# Altium schematic sheet 1_Main.SchDoc: Power, MCU, Control
size 292 x 206 mm; DrawnBy: Martin Cejp; SheetNumber: 1; SheetTotal: 2; TemplateRevision: v2.0
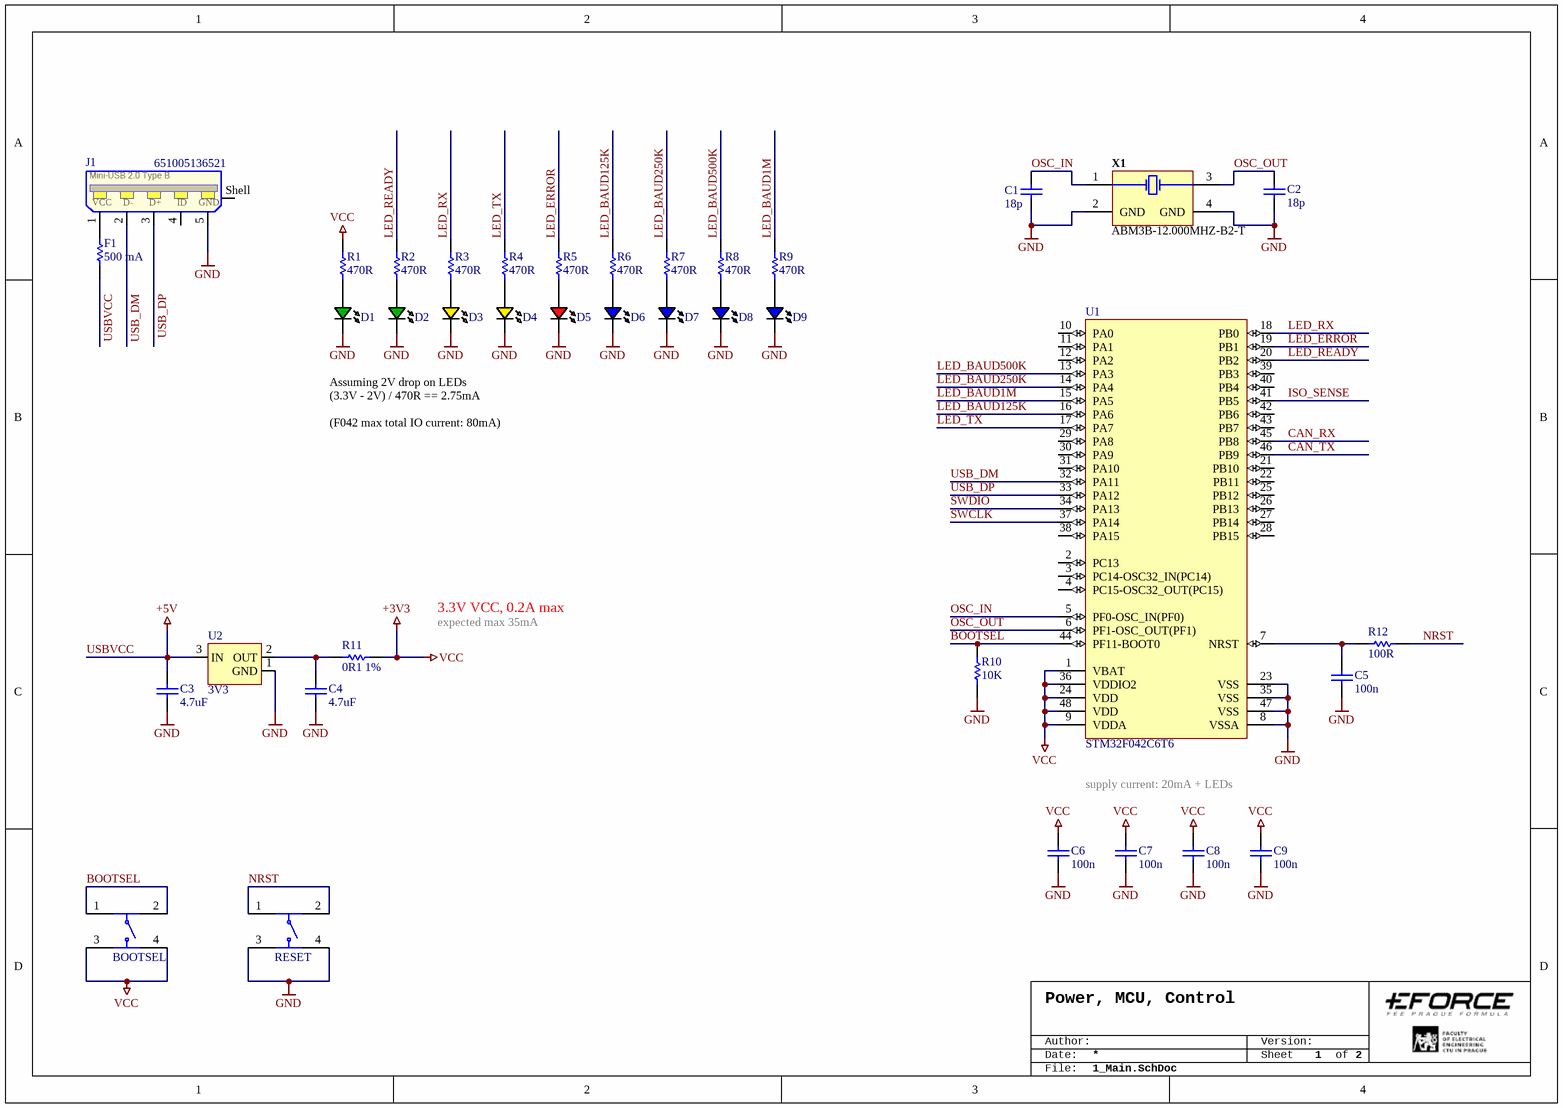
[diagram p0: 1_Main.SchDoc]

## Parts
BOOTSEL  430181038816  [BUTTON_4x3x2]  (value not drawn)
C1  18p  [CAPC0603(1608)100_M]
C2  18p  [CAPC0603(1608)100_M]
C3  4.7uF  [CAPC0805(2012)155_M]
C4  4.7uF  [CAPC0805(2012)155_M]
C5  100n  [CAPC0603(1608)100_M]
C6  100n  [CAPC0603(1608)100_M]
C7  100n  [CAPC0603(1608)100_M]
C8  100n  [CAPC0603(1608)100_M]
C9  100n  [CAPC0603(1608)100_M]
D1  green  [0805LEDG]  (value not drawn)
D2  green  [0805LEDG]  (value not drawn)
D3  yellow  [0805LEDYell]  (value not drawn)
D4  yellow  [0805LEDYell]  (value not drawn)
D5  red  [0805LEDR]  (value not drawn)
D6  blue  [0805LEDB]  (value not drawn)
D7  blue  [0805LEDB]  (value not drawn)
D8  blue  [0805LEDB]  (value not drawn)
D9  blue  [0805LEDB]  (value not drawn)
F1  500 mA  [RESC1812(4532)_L]
J1  651005136521  [MOLEX_548190519]
R1  470R  [RESC0603(1608)_N]
R2  470R  [RESC0603(1608)_N]
R3  470R  [RESC0603(1608)_N]
R4  470R  [RESC0603(1608)_N]
R5  470R  [RESC0603(1608)_N]
R6  470R  [RESC0603(1608)_N]
R7  470R  [RESC0603(1608)_N]
R8  470R  [RESC0603(1608)_N]
R9  470R  [RESC0603(1608)_N]
R10  10K  [RESC0603(1608)_N]
R11  0R1 1%  [RESC1206(3216)_L]
R12  100R  [RESC0603(1608)_L]
RESET  430181038816  [BUTTON_4x3x2]  (value not drawn)
U1  STM32F042C6T6  [STM-LQFP48_M]
U2  3V3  [SOT23m]
X1  ABM3B-12.000MHZ-B2-T  [ABRA-ABM3B-4_V]

## Nets
+3V3: BOOTSEL.3 BOOTSEL.4 C6.1 C7.1 C8.1 C9.1 R1.2 R11.2 U1.1(VBAT) U1.9(VDDA) U1.24(VDD) U1.36(VDDIO2) U1.48(VDD)  [also labelled VCC]
GND: C1.1 C2.1 C3.1 C4.1 C5.1 C6.2 C7.2 C8.2 C9.2 D1.K D2.K D3.K D4.K D5.K D6.K D7.K D8.K D9.K J1.5(GND) R10.1 RESET.3 RESET.4 U1.8(VSSA) U1.23(VSS) U1.35(VSS) U1.47(VSS) U2.1(GND) X1.2(GND) X1.4(GND)
USBVCC: C3.2 F1.2 U2.3(IN)  [also labelled +5V]
BOOTSEL: BOOTSEL.1 BOOTSEL.2 R10.2 U1.44(PF11-BOOT0)
CAN_RX: U1.45(PB8)
CAN_TX: U1.46(PB9)
ISO_SENSE: U1.41(PB5)
LED_BAUD1M: R9.1 U1.15(PA5)
LED_BAUD125K: R6.1 U1.16(PA6)
LED_BAUD250K: R7.1 U1.14(PA4)
LED_BAUD500K: R8.1 U1.13(PA3)
LED_ERROR: R5.1 U1.19(PB1)
LED_READY: R2.2 U1.20(PB2)
LED_RX: R3.1 U1.18(PB0)
LED_TX: R4.1 U1.17(PA7)
NRST: R12.2 RESET.1 RESET.2
OSC_IN: C1.2 U1.5(PF0-OSC_IN(PF0)) X1.1(X1)
OSC_OUT: C2.2 U1.6(PF1-OSC_OUT(PF1)) X1.3(X2)
SWCLK: U1.37(PA14)
SWDIO: U1.34(PA13)
USB_DM: J1.2(D-) U1.32(PA11)
USB_DP: J1.3(D+) U1.33(PA12)
NetC4_2: C4.2 R11.1 U2.2(OUT)
NetC5_2: C5.2 R12.1 U1.7(NRST)
NetD1_A: D1.A R1.1
NetD2_A: D2.A R2.1
NetD3_A: D3.A R3.2
NetD4_A: D4.A R4.2
NetD5_A: D5.A R5.2
NetD6_A: D6.A R6.2
NetD7_A: D7.A R7.2
NetD8_A: D8.A R8.2
NetD9_A: D9.A R9.2
NetF1_1: F1.1 J1.1(VCC)

Not connected (* = marked no-connect by the designer): J1 4(ID) Shell; U1 2(PC13) 3(PC14-OSC32_IN(PC14)) 4(PC15-OSC32_OUT(PC15)) 10(PA0) 11(PA1) 12(PA2) 21(PB10) 22(PB11) 25(PB12) 26(PB13) 27(PB14) 28(PB15) 29(PA8) 30(PA9) 31(PA10) 38(PA15) 39(PB3) 40(PB4) 42(PB6) 43(PB7)

## Notes on the sheet
- Assuming 2V drop on LEDs
  (3.3V - 2V) / 470R == 2.75mA
  (F042 max total IO current: 80mA)
- 3.3V VCC, 0.2A max
- expected max 35mA
- supply current: 20mA + LEDs
- Date:
- Author:
- Sheet
- Version:
- of
- File:
- (in symbol 651005136521) Mini-USB 2.0 Type B

## Library data of the parts
BOOTSEL RESET = WS-TASV, 430181038816: WS-TASV 4.5x4.5 mm SMD; Manufacturer: Wurth Elektronik; partNo: 430181038816; ComponentLink1Description: Manufacturer; ComponentLink1URL: http://www.we-online.de; Created by: Baojun Chen; Created Date: Dec.2015; ComponentLink2Description: Datasheet; ComponentLink2URL: http://katalog.we-online.de/em/datasheet/430181038816.pdf
C1 C2 = CMP-1035-00733-1: CAP 18pF 10V ±10% 0603 (1608 Metric) Thickness 1mm SMD; Case-Metric: 1608; Tolerance: Â±10%; Case-EIA: 0603; Technology: SMT; Value: 18pF; Max Thickness: 1 mm; Rated Voltage: 10 V
C3 C4 = CMP-1036-04892-1: CAP 4.7uF 16V ±20% 0805 (2012 Metric) Thickness 1.55mm SMD; Case-EIA: 0805; Tolerance: Â±20%; Case-Metric: 2012; Rated Voltage: 16 V; Value: 4.7uF; Max Thickness: 1.55 mm; Technology: SMT
C5-C9 = CMP-1035-02576-1: CAP 100nF 6.3V ±10% 0603 (1608 Metric) Thickness 1mm SMD; Tolerance: Â±10%; Case-Metric: 1608; Case-EIA: 0603; Max Thickness: 1 mm; Value: 100nF; Rated Voltage: 6.3 V; Technology: SMT
D1 D2 = LEDG_0805
D3 D4 = LEDYell_0805
D5 = LEDR_0805
D6-D9 = LEDB_0805
F1 = CMP-1016-00152-1: 1R02 0.75W 1% 1812 (4532 Metric)  SMD; Value: 1.02 Ohm; Case-EIA: 1812; Case-Metric: 4532; Power: 0.75 W; Tolerance: 1 %; Technology: SMT
J1 = 651005136521: WR-COM Mini USB 2.0 Type B Horizontal 5 Contacts; Published: June 2016; Publisher: Wurth Elektronik; ComponentLink1Description: Manufacturer; ComponentLink1URL: http://www.we-online.de; ComponentLink2Description: Datasheet; ComponentLink2URL: http://katalog.we-online.de/em/datasheet/651005136521.pdf; PartNumber: 651005136521
R1-R9 = CMP-1012-00066-1: 470R 0.1W 5% 0603 (1608 Metric)  SMD; Case-Metric: 1608; Case-EIA: 0603; Value: 470.00 Ohm; Tolerance: 5 %; Technology: SMT; Power: 0.1 W
R10 = CMP-1012-00098-1: 10K 0.1W 5% 0603 (1608 Metric)  SMD; Case-EIA: 0603; Value: 10000.00 Ohm; Case-Metric: 1608; Technology: SMT; Tolerance: 5 %; Power: 0.1 W
R11 = CMP-1014-00003-1: 0R1 0.25W 1% 1206 (3216 Metric)  SMD; Value: 1.10 Ohm; Tolerance: 5 %; Case-Metric: 3216; Case-EIA: 1206; Power: 0.25 W; Technology: SMT
R12 = CMP-1012-00050-1: 100R 0.1W 5% 0603 (1608 Metric)  SMD; Case-EIA: 0603; Value: 100.00 Ohm; Case-Metric: 1608; Tolerance: 5 %; Technology: SMT; Power: 0.1 W
U1 = CMP-0304-00103-1: ARM Cortex-M0 32-bit MCU, 32 KB Flash, 6 KB Internal RAM, 38 I/Os, 48-Pin LQFP, -40 to 85 degC, Tray; Operating Frequency(F) (Processor speed) (MHz): 48; FLASH Size (Prog) (kB): 32; Supply Voltage(Vcc) min (V): 2; Internal RAM Size (kB): 6; I/Os (High Current): 38; DatasheetVersion: Rev. 5; Core: ARM Cortex-M0; Mounting Technology: Surface Mount; Package Description: 48-Pin Low Profile Quad Flat Package, Body 7 x 7 mm, Pitch 0.5 mm; ComponentLink2Description: Datasheet; Package Reference: LQFP48; Packing: Tray; ComponentLink1Description: Manufacturer URL; ComponentLink1URL: http://www.st.com/; ComponentLink2URL: http://www.st.com/st-web-ui/static/active/en/resource/technical/document/datasheet/DM00105814.pdf
U2 = LM1117DT-3.3NOPB: 1.8V Voltage reference; Alias: MCP1700; Suplier: Farnell
X1 = CMP-1688-00007-1: Ceramic SMD Crystal, 12 MHz, +/- 20 ppm, 70 Ohm, -20 to 70 degC, 4-Pin SMD, RoHS, Tape and Reel; Case\Package: TO-263-4; Outputs: 1; Max Input Voltage: 25 V; Dropout Voltage: 2 V; Max Ouput Current: 1.5 A; Nominal Output Voltage: 5 V; Min Input Voltage: 7 V; Mount: Surface Mount; ComponentLink2Description: Datasheet; DatasheetVersion: Aug-15; PackageReference: ABM3B; Radiation Hardening: No; Weight: 0.050897 oz; ComponentLink1URL: http://www.abracon.com/; RoHSCompliant: true; Max Operating Temperature: 125 degC; PackageDescription: 4-Pin Surface Mount Device, Body 5 x 3.2 mm; ComponentLink1Description: Manufacturer URL; Package Quantity: 500; Output Voltage: 5 V; ComponentLink2URL: http://www.abracon.com/Resonators/abm3b.pdf; Min Operating Temperature: 0 degC; Output Current: 1.5 A; Packaging: Tape and Reel; Pins: 3; REACH SVHC: No SVHC